# EAGLE design schematic (EAGLE 9.6.2)
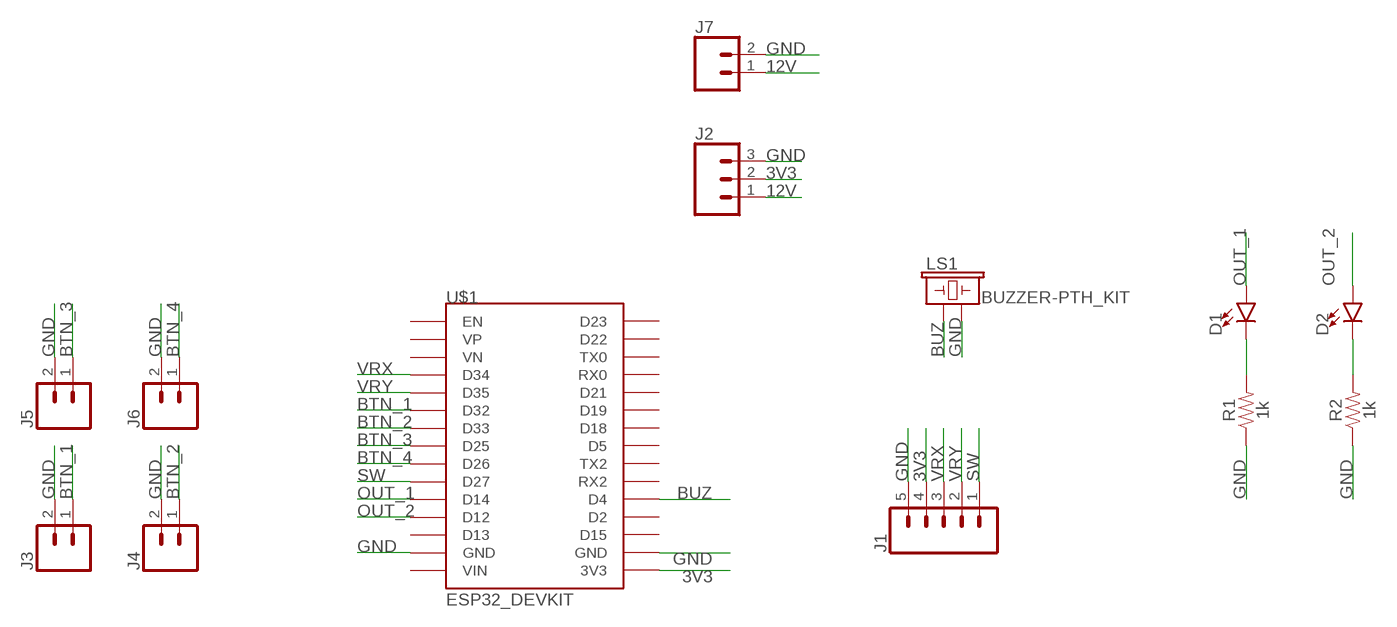
[diagram p0: schematic, sheet 1]

## Parts
D1  LED5MM  [LED_5MM]
D2  LED5MM  [LED_5MM]
J1  CONN_05LOCK  [1X05_LOCK]
J2  CONN_03SCREW  [SCREWTERMINAL-3.5MM-3]
J3  CONN_02  [1X02]
J4  CONN_02  [1X02]
J5  CONN_02  [1X02]
J6  CONN_02  [1X02]
J7  CONN_02LOCK  [1X02_LOCK]
LS1  BUZZER-PTH_KIT  [BUZZER-12MM-KIT]
R1  1k  1KOHM-HORIZ-1/4W-5%  [AXIAL-0.3]
R2  1k  1KOHM-HORIZ-1/4W-1%  [AXIAL-0.3]
U$1  ESP32_DEVKIT  [ESP32_DEVKIT]

## Nets
3V3: J1.4 J2.2 U$1.3V3
12V: J2.1 J7.1
BTN_1: J3.1 U$1.D32
BTN_2: J4.1 U$1.D33
BTN_3: J5.1 U$1.D25
BTN_4: J6.1 U$1.D26
BUZ: LS1.+ U$1.D4
GND: J1.5 J2.3 J3.2 J4.2 J5.2 J6.2 J7.2 LS1.- R1.P$1 R2.P$1 U$1.GND@1(GND) U$1.GND@2(GND)
N$1: D1.K(C) R1.P$2
N$2: D2.K(C) R2.P$2
OUT_1: D1.A U$1.D14
OUT_2: D2.A U$1.D12
SW: J1.1 U$1.D27
VRX: J1.3 U$1.D34
VRY: J1.2 U$1.D35
Unconnected: U$1.D2 U$1.D5 U$1.D13 U$1.D15 U$1.D18 U$1.D19 U$1.D21 U$1.D22 U$1.D23 U$1.EN U$1.RX0 U$1.RX2 U$1.TX0 U$1.TX2 U$1.VIN U$1.VN U$1.VP

## Library data of the parts
D1 D2 = SparkFun-LED:LED: LED (Generic) Standard schematic elements and footprints for 5mm, 3mm, 1206, and 0603 sized LEDs. Generic LEDs with no color specified.
J1 = SparkFun-Connectors:CONN_05: Multi connection point. Often used as Generic Header-pin footprint for 0.1 inch spaced/style header connections On any of the 0.1 inch spaced packages, you can populate with these: Break Away Headers - Straight <https://www.sparkfun.com/products/116> (PRT-00116) Break Away Male Headers - Right Angle <https://www.sparkfun.com/products/553> (PRT-00553) Female Headers <https://www.sparkfun.com/products/115> (PRT-00115) Break Away Headers - Machine Pin <https://www.sparkfun.com/products/117> (PRT-00117) Break Away Female Headers - Swiss Machine Pin <https://www.sparkfun.com/products/743> (PRT-00743) For SCREWTERMINALS and SPRING TERMINALS visit here: Screw Terimnals on SparkFun.com <https://www.sparkfun.com/search/results?term=Screw+Terminals> (5mm/3.5mm/2.54mm spacing) This device is also useful as a general connection point to wire up your design to another part of your project. Our various solder wires solder well into these plated through hole pads. Hook-Up Wire - Assortment (Stranded, 22 AWG) <https://www.sparkfun.com/products/11375> (PRT-11375) Hook-Up Wire - Assortment (Solid Core, 22 AWG) <https://www.sparkfun.com/products/11367> (PRT-11367) View the entire wire category on our website here <https://www.sparkfun.com/categories/141> Special notes: Molex polarized connector foot print use with SKU : PRT-08231 with associated crimp pins and housings. 1MM SMD Version SKU: PRT-10208
J2 = SparkFun-Connectors:CONN_03: Multi connection point. Often used as Generic Header-pin footprint for 0.1 inch spaced/style header connections On any of the 0.1 inch spaced packages, you can populate with these: Break Away Headers - Straight <https://www.sparkfun.com/products/116> (PRT-00116) Break Away Male Headers - Right Angle <https://www.sparkfun.com/products/553> (PRT-00553) Female Headers <https://www.sparkfun.com/products/115> (PRT-00115) Break Away Headers - Machine Pin <https://www.sparkfun.com/products/117> (PRT-00117) Break Away Female Headers - Swiss Machine Pin <https://www.sparkfun.com/products/743> (PRT-00743) Stackable Header - 3 Pin (Female, 0.1") <https://www.sparkfun.com/products/13875> (PRT-13875) For SCREWTERMINALS and SPRING TERMINALS visit here: Screw Terimnals on SparkFun.com <https://www.sparkfun.com/search/results?term=Screw+Terminals> (5mm/3.5mm/2.54mm spacing) This device is also useful as a general connection point to wire up your design to another part of your project. Our various solder wires solder well into these plated through hole pads. Hook-Up Wire - Assortment (Stranded, 22 AWG) <https://www.sparkfun.com/products/11375> (PRT-11375) Hook-Up Wire - Assortment (Solid Core, 22 AWG) <https://www.sparkfun.com/products/11367> (PRT-11367) View the entire wire category on our website here <https://www.sparkfun.com/categories/141> Special notes: Molex polarized connector foot print use with SKU : PRT-08232 with associated crimp pins and housings.; PROD_ID: CONN-08288; SF_ID: PRT-08235
J3-J7 = SparkFun-Connectors:CONN_02: Multi connection point. Often used as Generic Header-pin footprint for 0.1 inch spaced/style header connections On any of the 0.1 inch spaced packages, you can populate with these: Break Away Headers - Straight <https://www.sparkfun.com/products/116> (PRT-00116) Break Away Male Headers - Right Angle <https://www.sparkfun.com/products/553> (PRT-00553) Female Headers <https://www.sparkfun.com/products/115> (PRT-00115) Break Away Headers - Machine Pin <https://www.sparkfun.com/products/117> (PRT-00117) Break Away Female Headers - Swiss Machine Pin <https://www.sparkfun.com/products/743> (PRT-00743) For SCREWTERMINALS and SPRING TERMINALS visit here: Screw Terimnals on SparkFun.com <https://www.sparkfun.com/search/results?term=Screw+Terminals> (5mm/3.5mm/2.54mm spacing) This device is also useful as a general connection point to wire up your design to another part of your project. Our various solder wires solder well into these plated through hole pads. Hook-Up Wire - Assortment (Stranded, 22 AWG) <https://www.sparkfun.com/products/11375> (PRT-11375) Hook-Up Wire - Assortment (Solid Core, 22 AWG) <https://www.sparkfun.com/products/11367> (PRT-11367) View the entire wire category on our website here <https://www.sparkfun.com/categories/141> Special notes: Molex polarized connector foot print use with: PRT-08233 with associated crimp pins and housings. 2.54_SCREWTERM for use with PRT-10571. 3.5mm Screw Terminal footprints for PRT-08084 5mm Screw Terminal footprints for use with PRT-08432
LS1 = SparkFun-Electromechanical:BUZZER: Buzzer Small round buzzers that operate around the audible 2kHz range. You can use these as speakers to create simple music or user interfaces. Variant Overview: PTH - Mini Speaker - PC Mount 12mm 2.048kHz <https://www.sparkfun.com/products/7950> PTH_KIT - Mini Speaker - PC Mount 12mm 2.048kHz <https://www.sparkfun.com/products/7950> KIT simplifies soldering by adding stop mask to one side of the pads. PTH_NO_SILK - Mini Speaker - PC Mount 12mm 2.048kHz <https://www.sparkfun.com/products/7950> No silkscreen indicator of buzzer outline. PTH_KIT_NO_SILK - Mini Speaker - PC Mount 12mm 2.048kHz <https://www.sparkfun.com/products/7950> KIT package w/o silkscreen SMD - Buzzer Audio Magnetic (CCV-084B16) SMD buzzer used on, e.g. the LilyPad Buzzer <https://www.sparkfun.com/products/8463> and RFID USB Reader <https://www.sparkfun.com/products/9963>. SMD_KIT - Buzzer Audio Magnetic (CCV-084B16) SMD Buzzer with elongated pins to make soldering easier. Used on the SparkFun Simon Says - Surface Mount Soldering Kit <https://www.sparkfun.com/products/10935>. SMD-SQUARE - Buzzer Audio Magnetic (COMP-15701) SMT square buzzer with one chamfered corner.; PROD_ID: COMP-08253; SF_SKU: COM-07950
R1 = SparkFun-Resistors:1KOHM: 1kΩ resistor A resistor is a passive two-terminal electrical component that implements electrical resistance as a circuit element. Resistors act to reduce current flow, and, at the same time, act to lower voltage levels within circuits. - Wikipedia; PROD_ID: RES-08380
R2 = SparkFun-Resistors:1KOHM: 1kΩ resistor A resistor is a passive two-terminal electrical component that implements electrical resistance as a circuit element. Resistors act to reduce current flow, and, at the same time, act to lower voltage levels within circuits. - Wikipedia; PROD_ID: RES-12182
U$1 = nodemcu:ESP32_DEVKIT: ESP32 DEVKIT BOARD

## Board
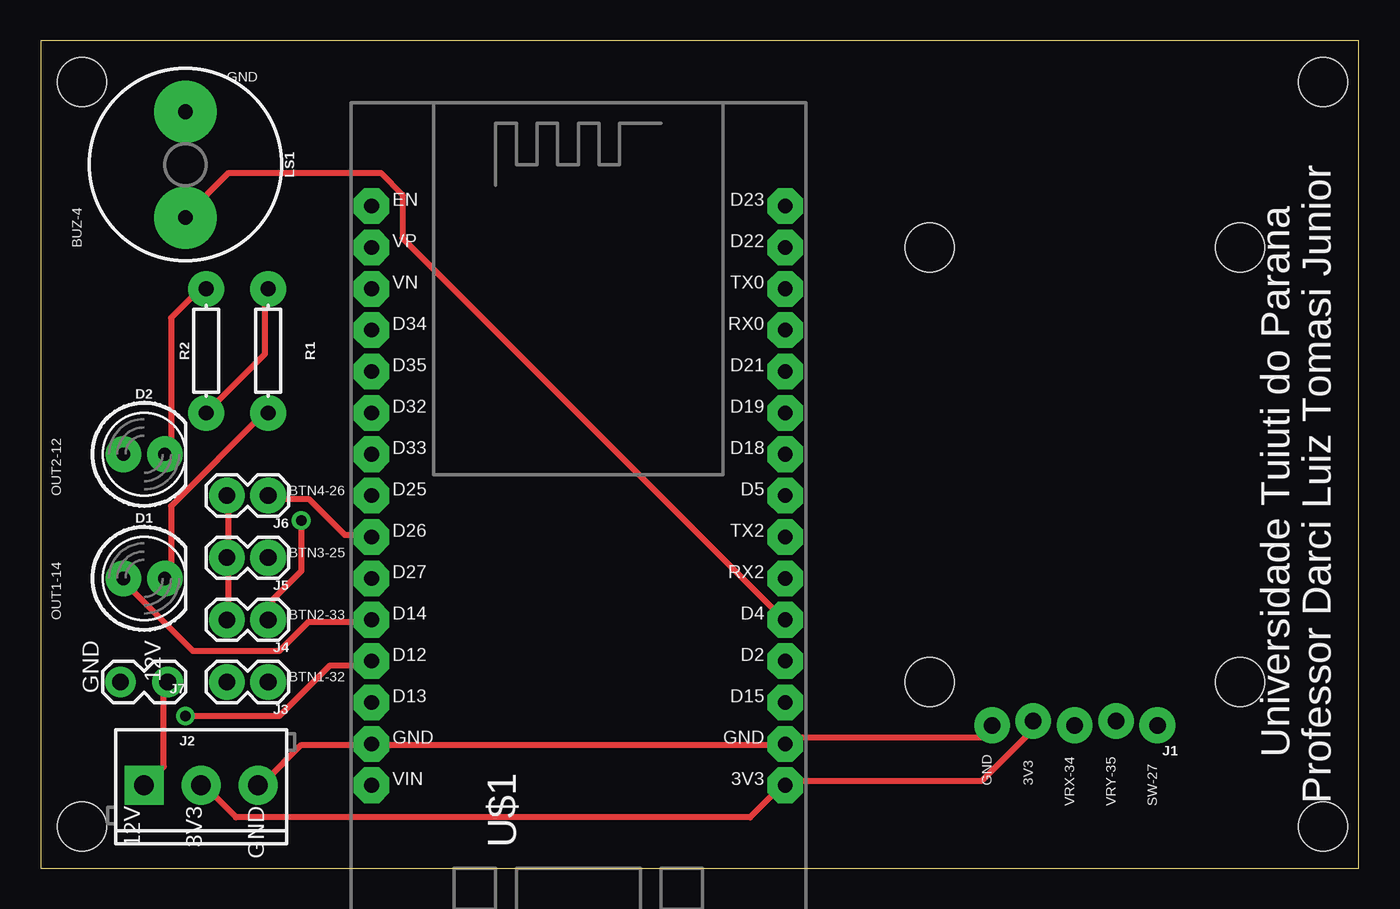
[diagram p1: board, top side]
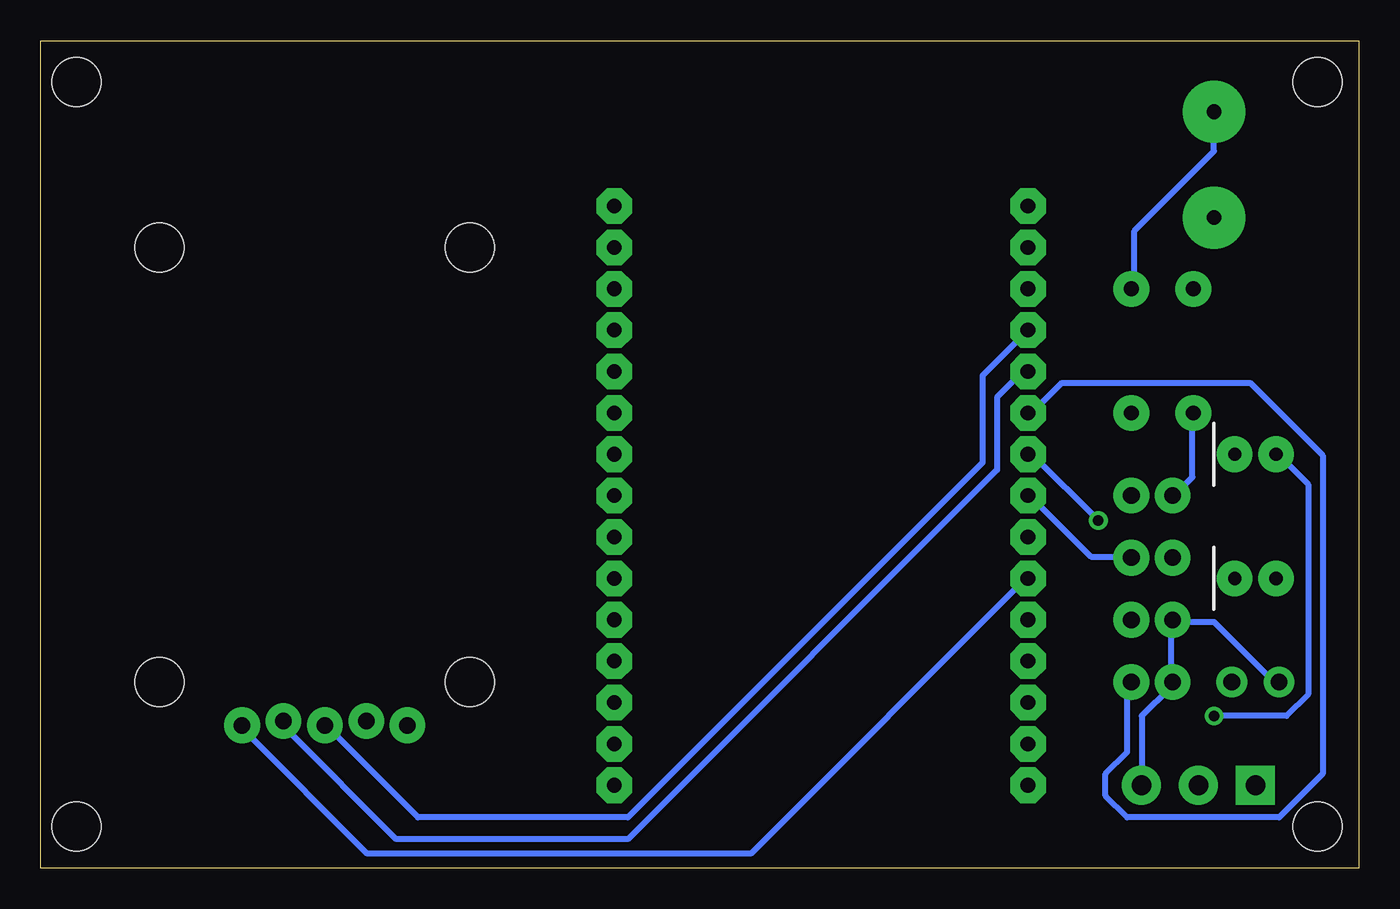
[diagram p2: board, bottom side, seen from below]

Size 80.95 x 50.79 mm. Coordinates in mm from the lower left corner, seen from the top.
Outline: 0,0 80.95,0 80.95,50.79 0,50.79 0,0
Copper layers (1*16): Top 0.035mm / dielectric 1.5mm / Bottom 0.035mm
Design rules "SparkFun": minimum track width 8mil, minimum drill 20mil, track to track 8mil, track to pad 8mil, pad to pad 8mil, via to via 8mil, smd to smd 8mil, copper to edge 8mil, drill to drill 8mil, minimum pad ring 12mil, minimum via ring 10mil, stop-mask expansion 4mil, vias tented up to drill 20mil, thermal gap 10mil
Holes 3 mm at 73.66,11.43 54.61,11.43 54.61,38.1 73.66,38.1 78.74,2.54 2.54,48.26 78.74,48.26 2.54,2.54

### Footprints (pad centres in the part's own frame; a part is rotated, then mirrored left to right if it is on the bottom)
LED_5MM = drill 0.813 pad 2.184: A -1.27,0; K 1.27,0
1X05_LOCK = drill 1.016 pad 2.184: 1 0,0.127; 2 2.54,-0.127; 3 5.08,0.127; 4 7.62,-0.127; 5 10.16,0.127
SCREWTERMINAL-3.5MM-3 = drill 1.2 pad 2.413 square: 1 0,0 | drill 1.2 pad 2.413: 2 3.5,0; 3 7,0
1X02 = drill 1.016 pad 2.184: 1 0,0; 2 2.54,0
1X02_LOCK = drill 1.016 pad 1.88: 1 -0.178,0; 2 2.718,0
BUZZER-12MM-KIT = drill 0.9 pad 3.81: + 3.25,0; - -3.25,0
AXIAL-0.3 = drill 0.9 pad 2.184: P$1 -3.81,0; P$2 3.81,0
ESP32_DEVKIT = drill 0.9 pad 2.184 octagon: 3V3 11.43,-17.78; D2 11.43,-10.16; D4 11.43,-7.62; D5 11.43,0; D12 -13.97,-10.16; D13 -13.97,-12.7; D14 -13.97,-7.62; D15 11.43,-12.7; D18 11.43,2.54; D19 11.43,5.08; D21 11.43,7.62; D22 11.43,15.24; D23 11.43,17.78; D25 -13.97,0; D26 -13.97,-2.54; D27 -13.97,-5.08; D32 -13.97,5.08; D33 -13.97,2.54; D34 -13.97,10.16; D35 -13.97,7.62; EN -13.97,17.78; GND@1 -13.97,-15.24; GND@2 11.43,-15.24; RX0 11.43,10.16; RX2 11.43,-5.08; TX0 11.43,12.7; TX2 11.43,-2.54; VIN -13.97,-17.78; VN -13.97,12.7; VP -13.97,15.24

### Placement (x,y rotation side)
D1  6.35,17.78 0 top
D2  6.35,25.4 0 top
J1  68.58,8.89 180 top
J2  6.35,5.08 0 top
J3  13.97,11.43 180 top
J4  13.97,15.24 180 top
J5  13.97,19.05 180 top
J6  13.97,22.86 180 top
J7  7.62,11.43 180 top
LS1  8.89,43.18 270 top
R1  13.97,31.75 270 top
R2  10.16,31.75 90 top
U$1  34.29,22.86 0 top

### Tracks (layer width: path | path; a pad name or v marks a point on that pad's centre or on a via)
3V3
  Top 0.381: J1.4 61.34,8.89 57.78,5.33 45.78,5.33 U$1.3V3 45.34,4.89 43.56,3.11 12,3.11 10.22,4.89 J2.2
12V
  Top 0.381: J7.1 7.56,11.11 7.56,6.22 6.67,5.33 J2.1
BTN_1
  Bottom 0.381: J3.1 14.22,11.11 14.22,7.11 15.56,5.78 15.56,4.45 14.22,3.11 4.89,3.11 2.22,5.78 2.22,25.34 6.67,29.78 18.22,29.78 20,28 U$1.D32
BTN_2  (via drill 0.65)
  Top 0.381: v16,21.34 16,18.22 14.22,16.45 14.22,15.56 J4.1
  Bottom 0.381: v16,21.34 20,25.34 U$1.D33
BTN_3
  Bottom 0.381: J5.1 14.22,19.11 16.45,19.11 20,22.67 U$1.D25
BTN_4
  Top 0.381: U$1.D26 20,20.45 18.67,20.45 16.45,22.67 14.22,22.67 J6.1
BUZ
  Top 0.381: U$1.D4 45.34,15.56 22.23,38.67 22.23,41.34 20.89,42.67 11.56,42.67 8.89,40.01 LS1.+
GND
  Top 0.381: J1.5 58.23,8.45 57.78,8 45.78,8 U$1.GND@2 45.34,7.56 20.45,7.56 U$1.GND@1 20,7.56 16,7.56 13.78,5.33 J2.3 | J4.2 11.56,15.56 11.56,18.67 J5.2 11.56,19.11 11.56,22.67 J6.2 | R2.P$1 13.78,31.56 13.78,35.56 R1.P$1
  Bottom 0.381: J7.2 5.33,11.56 8.89,15.11 11.11,15.11 J4.2 11.56,15.11 11.56,11.56 J3.2 11.56,11.11 13.34,9.34 13.34,5.33 J2.3 | R2.P$1 10.22,27.56 10.22,24 11.11,23.11 J6.2 | LS1.- 8.89,44.01 13.78,39.12 13.78,35.56 R1.P$1
N$1
  Top 0.381: D1.K 8,17.78 8,22.23 13.78,28 R1.P$2
N$2
  Top 0.381: D2.K 8,25.78 8,33.78 9.78,35.56 R2.P$2
OUT_1
  Top 0.381: U$1.D14 20,15.11 16.45,15.11 14.67,13.34 9.34,13.34 4.89,17.78 D1.A
OUT_2  (via drill 0.65)
  Top 0.381: v8.89,9.34 14.67,9.34 17.78,12.45 20,12.45 U$1.D12
  Bottom 0.381: v8.89,9.34 4.45,9.34 3.11,10.67 3.11,23.56 4.89,25.34 D2.A
SW
  Bottom 0.381: J1.1 68.45,8.45 60.9,0.89 37.34,0.89 20.45,17.78 U$1.D27
VRX
  Bottom 0.381: U$1.D34 23.11,30.23 23.11,24.89 44.9,3.11 57.78,3.11 63.12,8.45 J1.3
VRY
  Bottom 0.381: J1.2 65.79,8.89 65.79,8.45 59.12,1.78 44.9,1.78 22.23,24.45 22.23,28.89 20.45,30.67 U$1.D35

### Text on the board
tPlace: GND | Professor Darci Luiz Tomasi Junior | Universidade Tuiuti do Parana | BUZ-4 | OUT2-12 | BTN4-26 | BTN3-25 | OUT1-14 | BTN2-33 | GND | 12V | BTN1-32 | GND | 3V3 | 12V | 3V3 | GND | VRX-34 | VRY-35 | SW-27